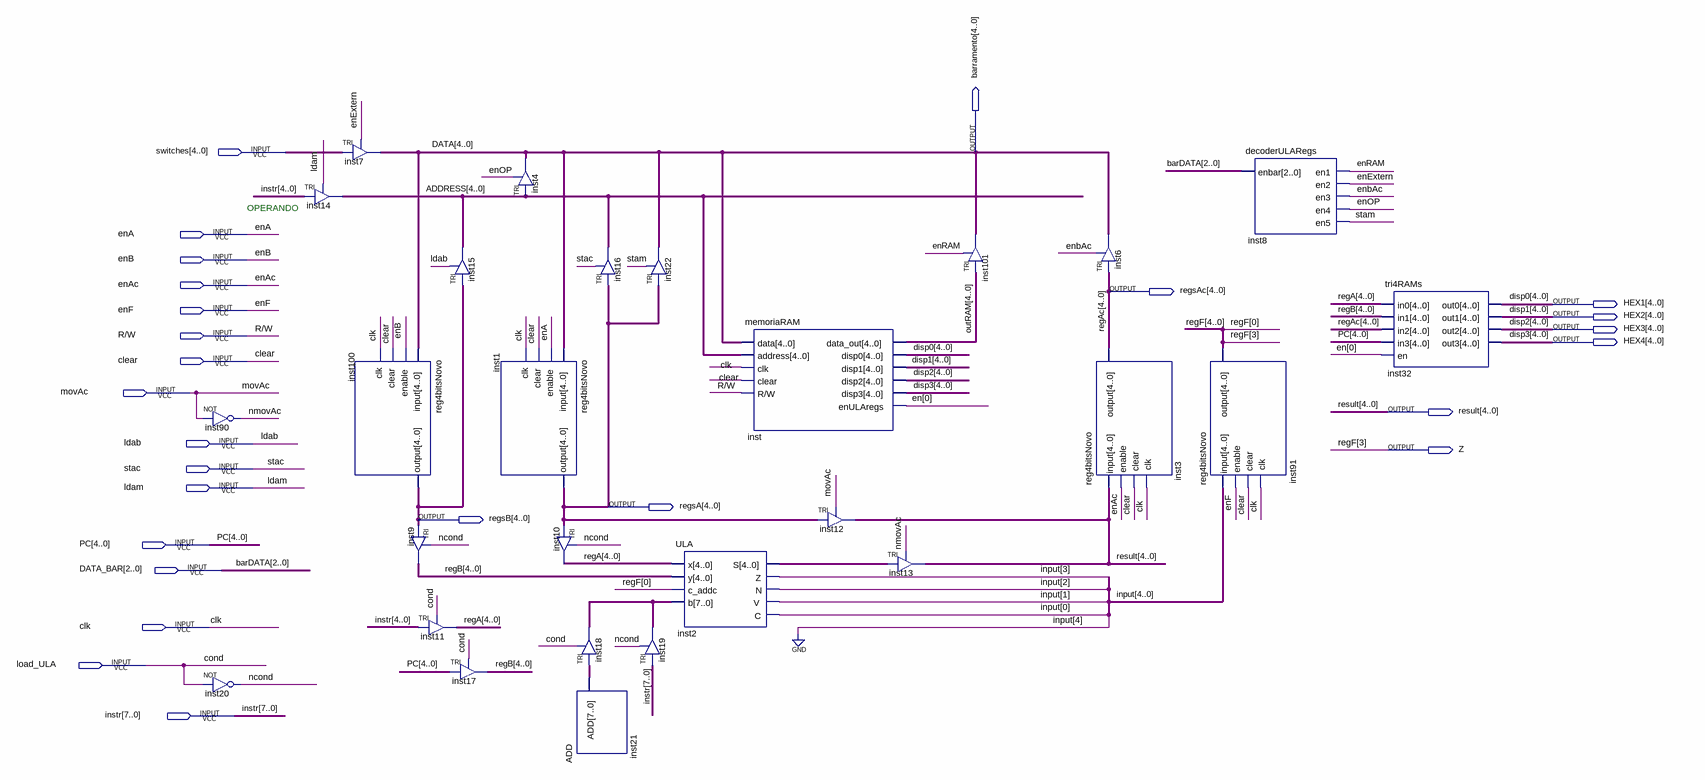
[diagram p0: schematic sheet]
// Quartus schematic circuitoRegsULA (cópia)(1).bdf as structural Verilog: 27 symbols, 26 pins
module \circuitoRegsULA_(cópia)(1)  (
  input  [4:0] switches,
  input  enA,
  input  enB,
  input  enAc,
  input  enF,
  input  \R/W ,
  input  clear,
  input  movAc,
  input  ldab,
  input  stac,
  input  ldam,
  input  [4:0] PC,
  input  [2:0] DATA_BAR,
  input  clk,
  input  load_ULA,
  input  [7:0] instr,
  output [4:0] barramento,
  output [4:0] regsAc,
  output [4:0] HEX1,
  output [4:0] HEX2,
  output [4:0] HEX3,
  output [4:0] HEX4,
  output [4:0] result,
  output Z,
  output [4:0] regsA,
  output [4:0] regsB
);

  wire enbAc, enExtern, enOP, enRAM, ncond, nmovAc, stam;
  wire [0:0] en;
  wire [3:0] \input ;
  wire [4:0] ADDRESS, inst2_s, outRAM, regA, regB, regF;
  wire [7:0] inst18_out, inst21_add;

  not inst90 (nmovAc, movAc);
  not inst20 (ncond, load_ULA);
  TRI inst14[4:0] (.IN(instr[4:0]), .OE(ldam), .OUT(ADDRESS));
  TRI inst7[4:0] (.IN(switches), .OE(enExtern), .OUT(barramento));
  reg4bitsNovo inst100 (.\input (barramento), .enable(enB), .clear(clear), .clk(clk), .\output (regsB));
  TRI inst9[4:0] (.IN(regsB), .OE(ncond), .OUT(regB));
  TRI inst11[4:0] (.IN(instr[4:0]), .OE(load_ULA), .OUT(regA));
  TRI inst15[4:0] (.IN(regsB), .OE(ldab), .OUT(ADDRESS));
  reg4bitsNovo inst1 (.\input (barramento), .enable(enA), .clear(clear), .clk(clk), .\output (regsA));
  TRI inst17[4:0] (.IN(PC), .OE(load_ULA), .OUT(regB));
  TRI inst4[4:0] (.IN(ADDRESS), .OE(enOP), .OUT(barramento));
  TRI inst10[4:0] (.IN(regsA), .OE(ncond), .OUT(regA));
  TRI inst18[7:0] (.IN(inst21_add), .OE(load_ULA), .OUT(inst18_out));
  ADD inst21 (.ADD(inst21_add));
  TRI inst16[4:0] (.IN(regsA), .OE(stac), .OUT(ADDRESS));
  TRI inst19[7:0] (.IN(instr), .OE(ncond), .OUT(inst18_out));
  TRI inst22[4:0] (.IN(regsA), .OE(stam), .OUT(barramento));
  ULA inst2 (
    .x(regA), .y(regB), .c_addc(regF[0]), .b(inst18_out), .S(inst2_s), .Z(\input [3]), .N(\input [2]),
    .V(\input [1]), .C(\input [0]));
  memoriaRAM inst (
    .data(barramento), .address(ADDRESS), .clk(clk), .clear(clear), .\R/W (\R/W ), .data_out(outRAM),
    .disp0(HEX1), .disp1(HEX2), .disp2(HEX3), .disp3(HEX4), .enULAregs(en[0]));
  TRI inst12[4:0] (.IN(regsA), .OE(movAc), .OUT(result));
  TRI inst13[4:0] (.IN(inst2_s), .OE(nmovAc), .OUT(result));
  TRI inst101[4:0] (.IN(outRAM), .OE(enRAM), .OUT(barramento));
  TRI inst6[4:0] (.IN(regsAc), .OE(enbAc), .OUT(barramento));
  reg4bitsNovo inst3 (.\input (result), .enable(enAc), .clear(clear), .clk(clk), .\output (regsAc));
  reg4bitsNovo inst91 (
    .\input ({1'b0, \input }), .enable(enF), .clear(clear), .clk(clk), .\output ({regF[4], Z, regF[2:0]}));
  decoderULARegs inst8 (.enbar(DATA_BAR), .en1(enRAM), .en2(enExtern), .en3(enbAc), .en4(enOP), .en5(stam));
  tri4RAMs inst32 (
    .in0(regA), .in1(regB), .in2(regsAc), .in3(PC), .en(en[0]), .out0(HEX1), .out1(HEX2), .out2(HEX3),
    .out3(HEX4));

  // Other names for the same wires on the sheet: barDATA[2:0] = DATA_BAR; cond = load_ULA; DATA[4:0] = barramento;
  //   disp0[4:0] = HEX1; disp1[4:0] = HEX2; disp2[4:0] = HEX3; disp3[4:0] = HEX4; regF[3] = Z; regAc[4:0] = regsAc

  // Notes on the sheet:
  //   OPERANDO
endmodule
